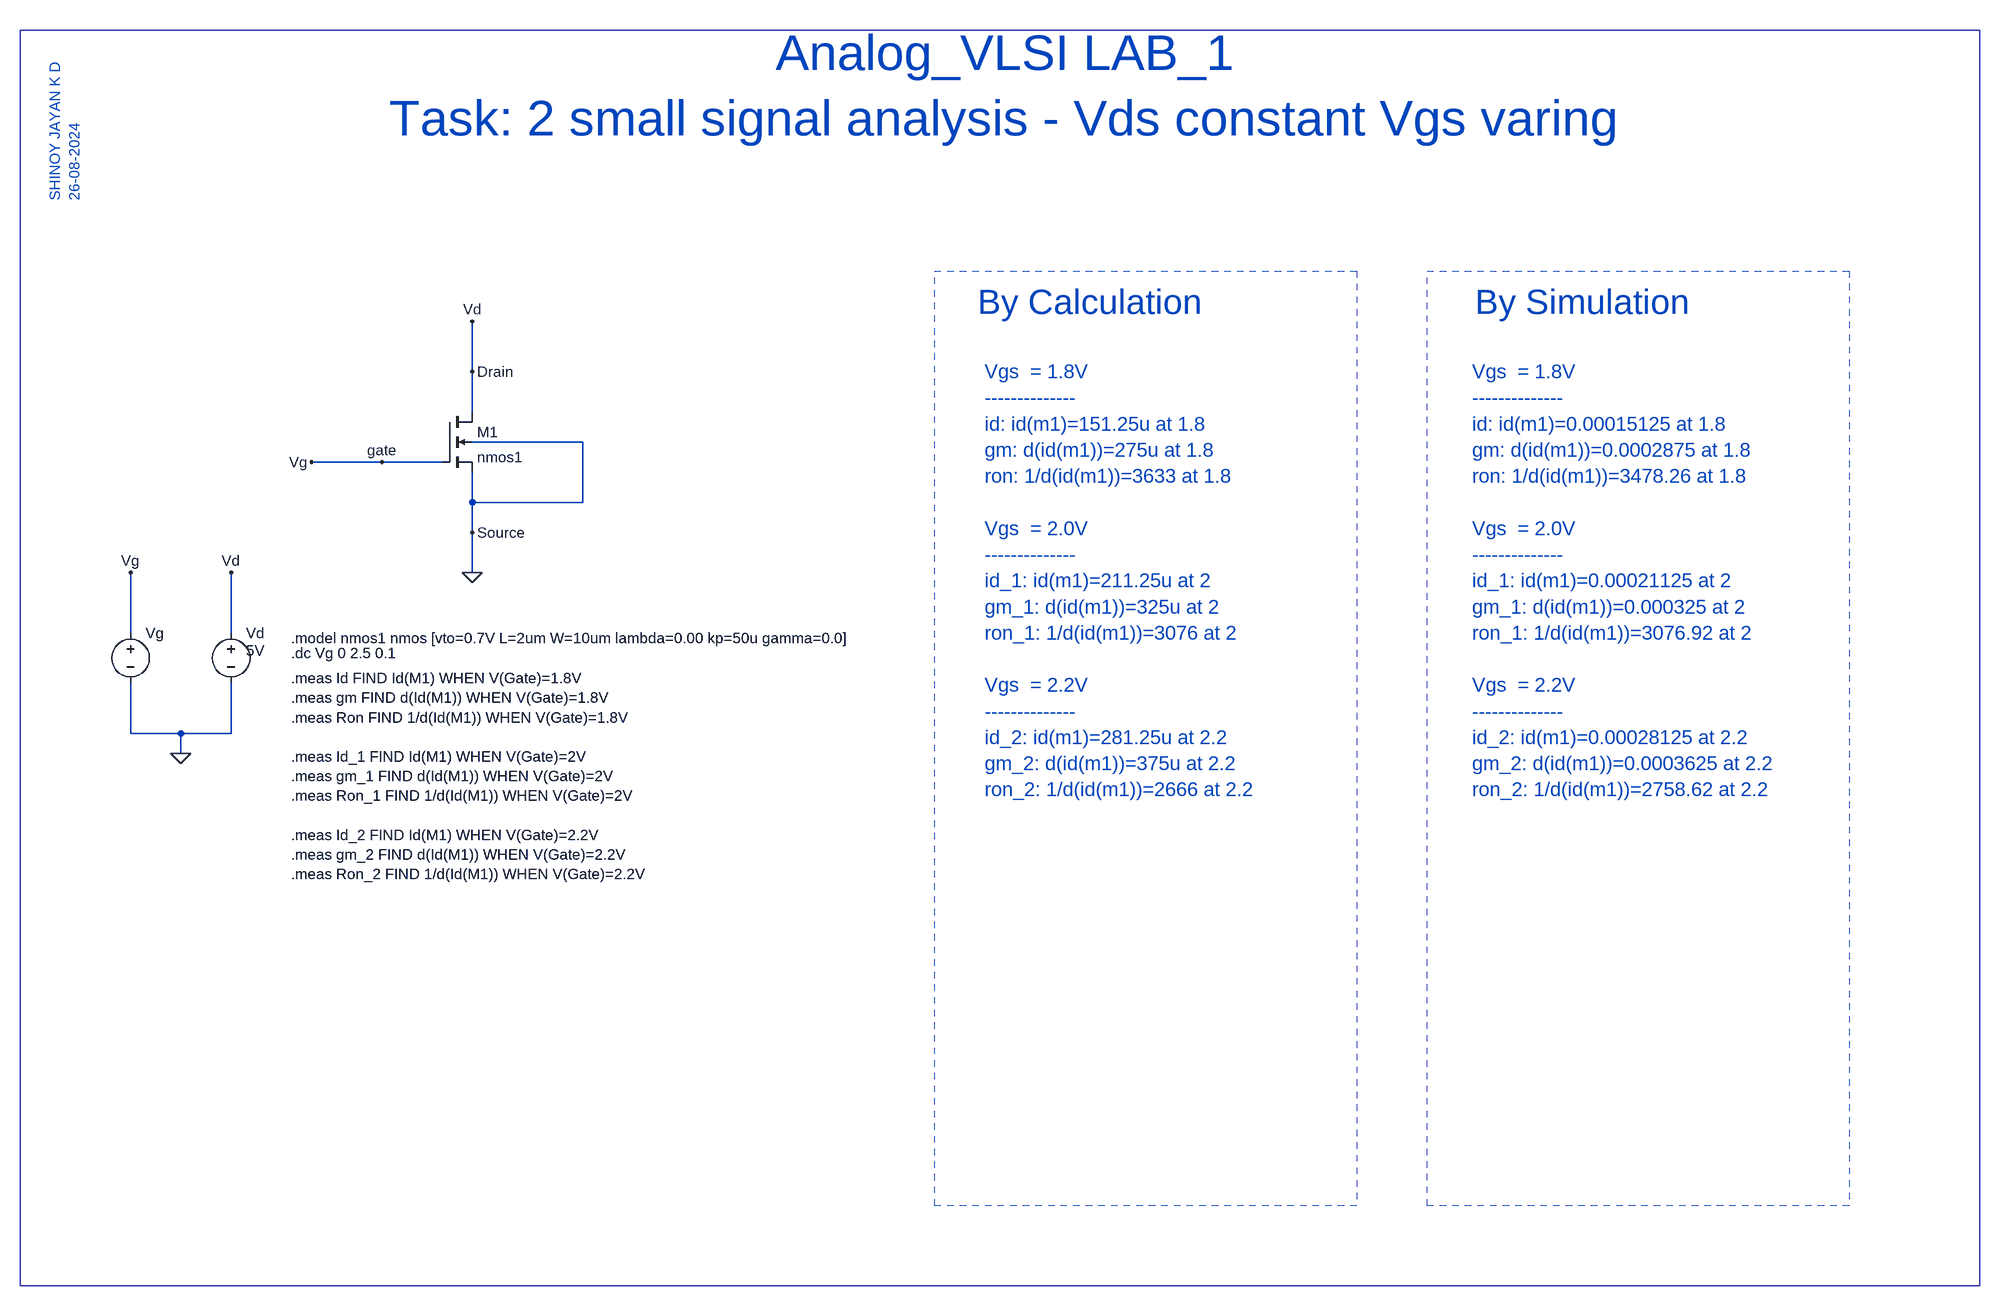
[diagram p0: schematic AVLSI_LAB_1_mosfet_charactristics_basic_2.asc]
AVLSI_LAB_1_mosfet_charactristics_basic_2.asc, the LTspice schematic file:
Version 4
SHEET 1 2788 1036
WIRE 48 -704 48 -784
WIRE 48 -640 48 -704
WIRE 224 -592 48 -592
WIRE -96 -560 -208 -560
WIRE 0 -560 -96 -560
WIRE 48 -496 48 -544
WIRE 224 -496 224 -592
WIRE 224 -496 48 -496
WIRE 48 -448 48 -496
WIRE 48 -384 48 -448
WIRE -496 -288 -496 -384
WIRE -336 -288 -336 -384
WIRE -496 -128 -496 -208
WIRE -416 -128 -496 -128
WIRE -336 -128 -336 -208
WIRE -336 -128 -416 -128
WIRE -416 -96 -416 -128
FLAG -416 -96 0
FLAG -496 -384 Vg
FLAG -336 -384 Vd
FLAG -208 -560 Vg
FLAG 48 -784 Vd
FLAG 48 -384 0
FLAG -96 -560 gate
FLAG 48 -704 Drain
FLAG 48 -448 Source
SYMBOL voltage -336 -304 R0
WINDOW 123 0 0 Left 0
WINDOW 39 0 0 Left 0
WINDOW 3 24 44 Left 2
SYMATTR Value 5V
SYMATTR InstName Vd
SYMBOL voltage -496 -304 R0
WINDOW 123 0 0 Left 0
WINDOW 39 0 0 Left 0
WINDOW 3 24 44 Left 2
SYMATTR Value ""
SYMATTR InstName Vg
SYMBOL nmos4 0 -640 R0
SYMATTR InstName M1
SYMATTR Value nmos1
TEXT 896 -1160 Center 6 ;Analog_VLSI LAB_1\nTask: 2 small signal analysis - Vds constant Vgs varing
TEXT -240 -280 Left 2 !.model nmos1 nmos [vto=0.7V L=2um W=10um lambda=0.00 kp=50u gamma=0.0]
TEXT -240 -256 Left 2 !.dc Vg 0 2.5 0.1
TEXT -240 -216 Left 2 !.meas Id FIND Id(M1) WHEN V(Gate)=1.8V\n.meas gm FIND d(Id(M1)) WHEN V(Gate)=1.8V\n.meas Ron FIND 1/d(Id(M1)) WHEN V(Gate)=1.8V\n \n.meas Id_1 FIND Id(M1) WHEN V(Gate)=2V\n.meas gm_1 FIND d(Id(M1)) WHEN V(Gate)=2V\n.meas Ron_1 FIND 1/d(Id(M1)) WHEN V(Gate)=2V\n \n.meas Id_2 FIND Id(M1) WHEN V(Gate)=2.2V\n.meas gm_2 FIND d(Id(M1)) WHEN V(Gate)=2.2V\n.meas Ron_2 FIND 1/d(Id(M1)) WHEN V(Gate)=2.2V
TEXT 1816 -816 Center 5 ;By Simulation
TEXT 1032 -816 Center 5 ;By Calculation
TEXT -616 -976 VLeft 2 ;SHINOY JAYAN K D\n26-08-2024
TEXT 1640 -704 Left 3 ;Vgs  = 1.8V\n--------------\nid: id(m1)=0.00015125 at 1.8\ngm: d(id(m1))=0.0002875 at 1.8\nron: 1/d(id(m1))=3478.26 at 1.8\n \nVgs  = 2.0V\n--------------\nid_1: id(m1)=0.00021125 at 2\ngm_1: d(id(m1))=0.000325 at 2\nron_1: 1/d(id(m1))=3076.92 at 2\n \nVgs  = 2.2V\n--------------\nid_2: id(m1)=0.00028125 at 2.2\ngm_2: d(id(m1))=0.0003625 at 2.2\nron_2: 1/d(id(m1))=2758.62 at 2.2
TEXT 864 -704 Left 3 ;Vgs  = 1.8V\n--------------\nid: id(m1)=151.25u at 1.8\ngm: d(id(m1))=275u at 1.8\nron: 1/d(id(m1))=3633 at 1.8\n \nVgs  = 2.0V\n--------------\nid_1: id(m1)=211.25u at 2\ngm_1: d(id(m1))=325u at 2\nron_1: 1/d(id(m1))=3076 at 2\n \nVgs  = 2.2V\n--------------\nid_2: id(m1)=281.25u at 2.2\ngm_2: d(id(m1))=375u at 2.2\nron_2: 1/d(id(m1))=2666 at 2.2
RECTANGLE Normal 2240 624 1568 -864 1
RECTANGLE Normal 1456 624 784 -864 1
RECTANGLE Normal 2448 752 -672 -1248

The netlist it stands for:
* AVLSI_LAB_1_mosfet_charactristics_basic_2.asc
Vd Drain 0 5V
Vg gate 0
M1 Drain gate 0 0 nmos1
.model NMOS NMOS
.model PMOS PMOS
.lib standard.mos
* Analog_VLSI LAB_1
* Task: 2 small signal analysis - Vds constant Vgs varing
.model nmos1 nmos [vto=0.7V L=2um W=10um lambda=0.00 kp=50u gamma=0.0]
.dc Vg 0 2.5 0.1
.meas Id FIND Id(M1) WHEN V(Gate)=1.8V
.meas gm FIND d(Id(M1)) WHEN V(Gate)=1.8V
.meas Ron FIND 1/d(Id(M1)) WHEN V(Gate)=1.8V
.meas Id_1 FIND Id(M1) WHEN V(Gate)=2V
.meas gm_1 FIND d(Id(M1)) WHEN V(Gate)=2V
.meas Ron_1 FIND 1/d(Id(M1)) WHEN V(Gate)=2V
.meas Id_2 FIND Id(M1) WHEN V(Gate)=2.2V
.meas gm_2 FIND d(Id(M1)) WHEN V(Gate)=2.2V
.meas Ron_2 FIND 1/d(Id(M1)) WHEN V(Gate)=2.2V
* By Simulation
* By Calculation
* SHINOY JAYAN K D
* 26-08-2024
* Vgs  = 1.8V
* --------------
* id: id(m1)=0.00015125 at 1.8
* gm: d(id(m1))=0.0002875 at 1.8
* ron: 1/d(id(m1))=3478.26 at 1.8
* Vgs  = 2.0V
* --------------
* id_1: id(m1)=0.00021125 at 2
* gm_1: d(id(m1))=0.000325 at 2
* ron_1: 1/d(id(m1))=3076.92 at 2
* Vgs  = 2.2V
* --------------
* id_2: id(m1)=0.00028125 at 2.2
* gm_2: d(id(m1))=0.0003625 at 2.2
* ron_2: 1/d(id(m1))=2758.62 at 2.2
* Vgs  = 1.8V
* --------------
* id: id(m1)=151.25u at 1.8
* gm: d(id(m1))=275u at 1.8
* ron: 1/d(id(m1))=3633 at 1.8
* Vgs  = 2.0V
* --------------
* id_1: id(m1)=211.25u at 2
* gm_1: d(id(m1))=325u at 2
* ron_1: 1/d(id(m1))=3076 at 2
* Vgs  = 2.2V
* --------------
* id_2: id(m1)=281.25u at 2.2
* gm_2: d(id(m1))=375u at 2.2
* ron_2: 1/d(id(m1))=2666 at 2.2
.backanno
.end

* Results of the author's LTspice run, read from the files saved beside the schematic
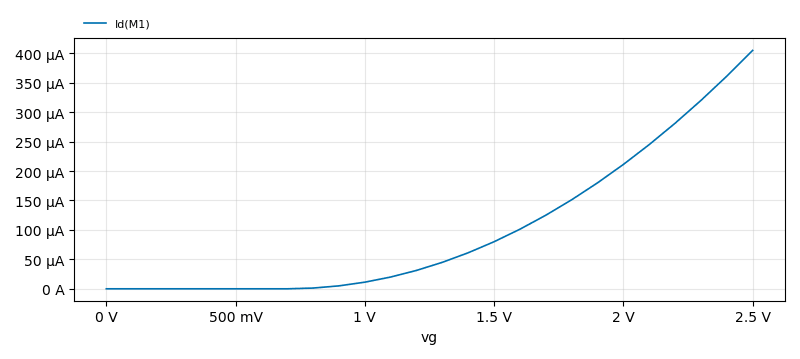
[diagram p1: DC transfer characteristic of AVLSI_LAB_1_mosfet_charactristics_basic_2.asc, plotted from the saved traces]
* DC transfer characteristic, 1 run:
*   Id(M1): 10.01 pA at vg=0 V, 405 µA at vg=2.5 V, min 10.01 pA, max 405 µA